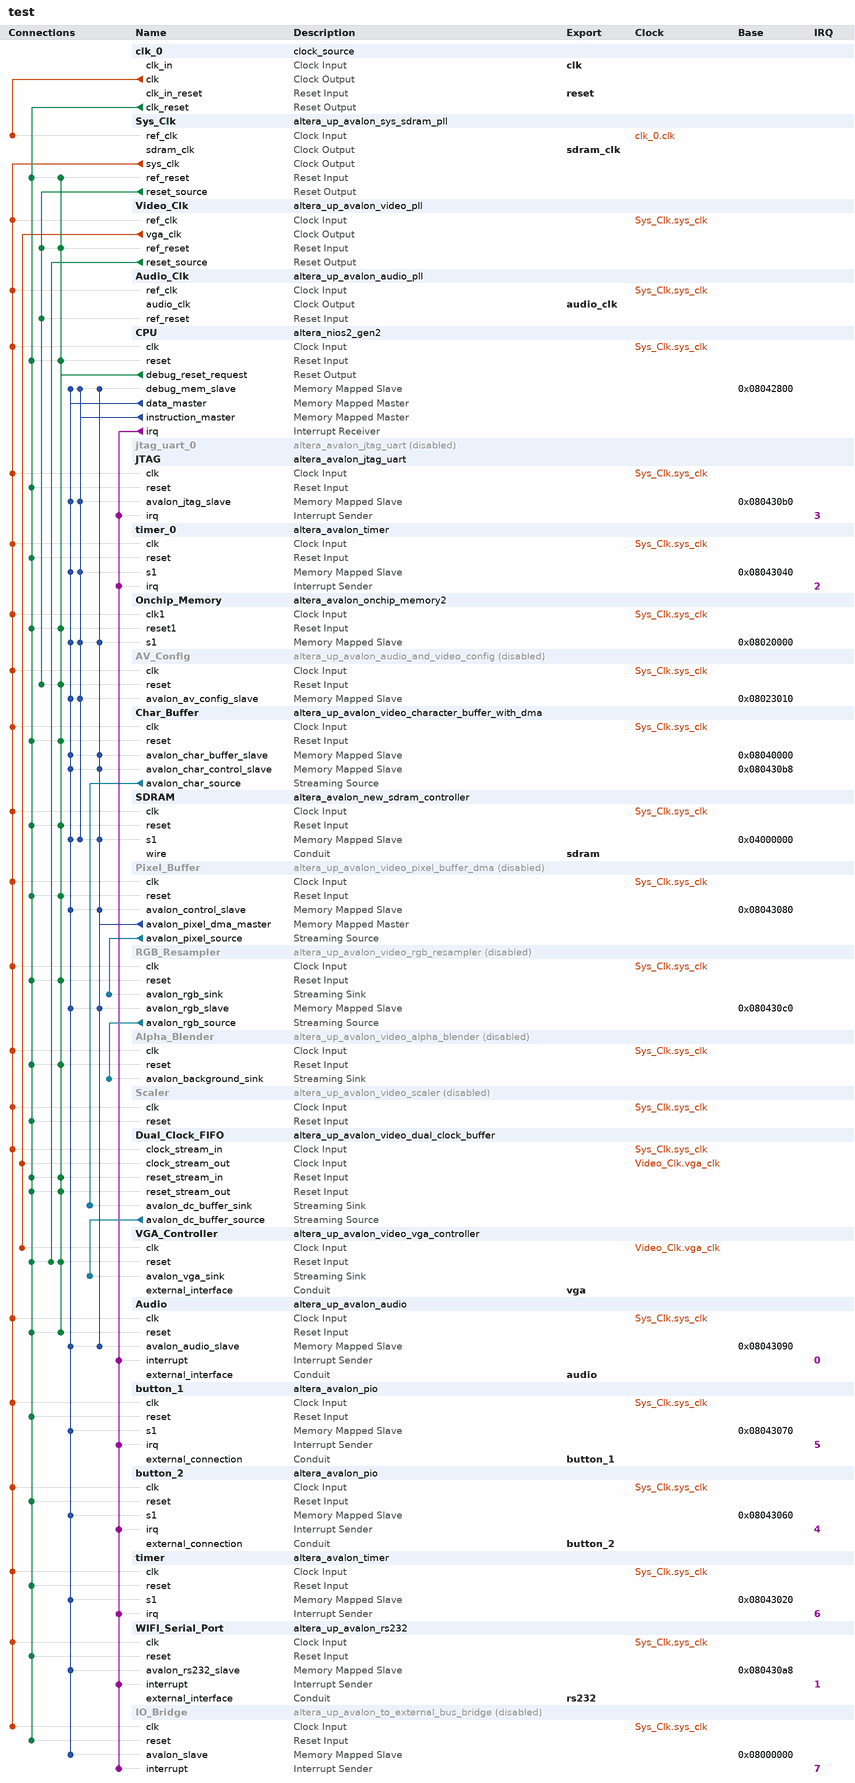
[diagram p0: system contents]
# Platform Designer (Qsys) system test, Cyclone V 5CSEMA5F31C6
# Parameters at their usual value, and those the tool derives, are not listed.
package require -exact qsys 18.0
create_system test
set_project_property DEVICE_FAMILY {Cyclone V}
set_project_property DEVICE 5CSEMA5F31C6

add_instance clk_0 clock_source 18.1
set_instance_parameter_value clk_0 clockFrequency 50000000

add_instance Sys_Clk altera_up_avalon_sys_sdram_pll 18.0
set_instance_parameter_value Sys_Clk CV_boards DE1-SoC
set_instance_parameter_value Sys_Clk gui_outclk 50.0
set_instance_parameter_value Sys_Clk gui_refclk 50.0

add_instance Video_Clk altera_up_avalon_video_pll 18.0
set_instance_parameter_value Video_Clk camera {5MP Digital Camera (THDB_D5M)}
set_instance_parameter_value Video_Clk gui_refclk 50.0
set_instance_parameter_value Video_Clk lcd {7" LCD on VEEK-MT and MTL/MTL2 Modules}

add_instance Audio_Clk altera_up_avalon_audio_pll 18.0
set_instance_parameter_value Audio_Clk gui_refclk 50.0

add_instance CPU altera_nios2_gen2 18.1
set_instance_parameter_value CPU dcache_size 2048
set_instance_parameter_value CPU exceptionSlave Onchip_Memory.s1
set_instance_parameter_value CPU icache_size 4096
set_instance_parameter_value CPU impl Fast
set_instance_parameter_value CPU resetSlave Onchip_Memory.s1

add_instance jtag_uart_0 altera_avalon_jtag_uart 18.1
set_instance_property jtag_uart_0 ENABLED false
set_instance_parameter_value jtag_uart_0 simInteractiveOptions NO_INTERACTIVE_WINDOWS

add_instance JTAG altera_avalon_jtag_uart 18.1
set_instance_parameter_value JTAG simInteractiveOptions NO_INTERACTIVE_WINDOWS

add_instance timer_0 altera_avalon_timer 18.1
set_instance_parameter_value timer_0 period 1
set_instance_parameter_value timer_0 periodUnits MSEC

add_instance Onchip_Memory altera_avalon_onchip_memory2 18.1
set_instance_parameter_value Onchip_Memory dataWidth 32
set_instance_parameter_value Onchip_Memory dualPort false
set_instance_parameter_value Onchip_Memory initMemContent true
set_instance_parameter_value Onchip_Memory initializationFileName onchip_mem.hex
set_instance_parameter_value Onchip_Memory memorySize 100000

add_instance AV_Config altera_up_avalon_audio_and_video_config 18.0
set_instance_property AV_Config ENABLED false
set_instance_parameter_value AV_Config audio_in {Microphone to ADC}
set_instance_parameter_value AV_Config bit_length 24
set_instance_parameter_value AV_Config board DE1-SoC
set_instance_parameter_value AV_Config eai false
set_instance_parameter_value AV_Config line_in_bypass false
set_instance_parameter_value AV_Config sampling_rate {48 kHz}

add_instance Char_Buffer altera_up_avalon_video_character_buffer_with_dma 18.0
set_instance_parameter_value Char_Buffer enable_transparency false

add_instance SDRAM altera_avalon_new_sdram_controller 18.1
set_instance_parameter_value SDRAM TAC 5.5
set_instance_parameter_value SDRAM TRCD 20.0
set_instance_parameter_value SDRAM TRP 20.0
set_instance_parameter_value SDRAM casLatency 3
set_instance_parameter_value SDRAM columnWidth 10
set_instance_parameter_value SDRAM dataWidth 16
set_instance_parameter_value SDRAM generateSimulationModel false
set_instance_parameter_value SDRAM model single_Micron_MT48LC4M32B2_7_chip
set_instance_parameter_value SDRAM numberOfBanks 4
set_instance_parameter_value SDRAM numberOfChipSelects 1
set_instance_parameter_value SDRAM powerUpDelay 100.0
set_instance_parameter_value SDRAM refreshPeriod 15.625
set_instance_parameter_value SDRAM rowWidth 13

add_instance Pixel_Buffer altera_up_avalon_video_pixel_buffer_dma 18.0
set_instance_property Pixel_Buffer ENABLED false
set_instance_parameter_value Pixel_Buffer addr_mode X-Y
set_instance_parameter_value Pixel_Buffer back_start_address 0
set_instance_parameter_value Pixel_Buffer color_space {8-bit RGB}
set_instance_parameter_value Pixel_Buffer image_height 480
set_instance_parameter_value Pixel_Buffer image_width 640
set_instance_parameter_value Pixel_Buffer start_address 0

add_instance RGB_Resampler altera_up_avalon_video_rgb_resampler 18.0
set_instance_property RGB_Resampler ENABLED false
set_instance_parameter_value RGB_Resampler alpha 1023
set_instance_parameter_value RGB_Resampler input_type {8-bit RGB}
set_instance_parameter_value RGB_Resampler output_type {30-bit RGB}

add_instance Alpha_Blender altera_up_avalon_video_alpha_blender 18.0
set_instance_property Alpha_Blender ENABLED false

add_instance Scaler altera_up_avalon_video_scaler 18.0
set_instance_property Scaler ENABLED false
set_instance_parameter_value Scaler color_bits 10
set_instance_parameter_value Scaler color_planes 3
set_instance_parameter_value Scaler height_scaling 2
set_instance_parameter_value Scaler width_in 320
set_instance_parameter_value Scaler width_scaling 2

add_instance Dual_Clock_FIFO altera_up_avalon_video_dual_clock_buffer 18.0
set_instance_parameter_value Dual_Clock_FIFO color_bits 10

add_instance VGA_Controller altera_up_avalon_video_vga_controller 18.0
set_instance_parameter_value VGA_Controller board DE1-SoC
set_instance_parameter_value VGA_Controller resolution {VGA 640x480}

add_instance Audio altera_up_avalon_audio 18.0
set_instance_parameter_value Audio audio_in true
set_instance_parameter_value Audio avalon_bus_type {Memory Mapped}
set_instance_parameter_value Audio dw 32

add_instance button_1 altera_avalon_pio 18.1
set_instance_parameter_value button_1 captureEdge true
set_instance_parameter_value button_1 direction Input
set_instance_parameter_value button_1 edgeType FALLING
set_instance_parameter_value button_1 generateIRQ true
set_instance_parameter_value button_1 width 1

add_instance button_2 altera_avalon_pio 18.1
set_instance_parameter_value button_2 captureEdge true
set_instance_parameter_value button_2 direction Input
set_instance_parameter_value button_2 edgeType FALLING
set_instance_parameter_value button_2 generateIRQ true
set_instance_parameter_value button_2 width 1

add_instance timer altera_avalon_timer 18.1
set_instance_parameter_value timer period 1
set_instance_parameter_value timer periodUnits MSEC

add_instance WIFI_Serial_Port altera_up_avalon_rs232 17.1
set_instance_parameter_value WIFI_Serial_Port baud 115200
set_instance_parameter_value WIFI_Serial_Port parity None

add_instance IO_Bridge altera_up_avalon_to_external_bus_bridge 18.0
set_instance_property IO_Bridge ENABLED false
set_instance_parameter_value IO_Bridge addr_size 64
set_instance_parameter_value IO_Bridge addr_size_multiplier Kbytes
set_instance_parameter_value IO_Bridge data_size 16

# connections
add_connection clk_0.clk Sys_Clk.ref_clk clock
add_connection Sys_Clk.sys_clk Alpha_Blender.clk clock
add_connection Sys_Clk.sys_clk Audio.clk clock
add_connection Sys_Clk.sys_clk Audio_Clk.ref_clk clock
add_connection Sys_Clk.sys_clk AV_Config.clk clock
add_connection Sys_Clk.sys_clk button_1.clk clock
add_connection Sys_Clk.sys_clk button_2.clk clock
add_connection Sys_Clk.sys_clk Char_Buffer.clk clock
add_connection Sys_Clk.sys_clk CPU.clk clock
add_connection Sys_Clk.sys_clk Dual_Clock_FIFO.clock_stream_in clock
add_connection Sys_Clk.sys_clk IO_Bridge.clk clock
add_connection Sys_Clk.sys_clk JTAG.clk clock
add_connection Sys_Clk.sys_clk Onchip_Memory.clk1 clock
add_connection Sys_Clk.sys_clk Pixel_Buffer.clk clock
add_connection Sys_Clk.sys_clk RGB_Resampler.clk clock
add_connection Sys_Clk.sys_clk Scaler.clk clock
add_connection Sys_Clk.sys_clk SDRAM.clk clock
add_connection Sys_Clk.sys_clk timer.clk clock
add_connection Sys_Clk.sys_clk timer_0.clk clock
add_connection Sys_Clk.sys_clk Video_Clk.ref_clk clock
add_connection Sys_Clk.sys_clk WIFI_Serial_Port.clk clock
add_connection Video_Clk.vga_clk Dual_Clock_FIFO.clock_stream_out clock
add_connection Video_Clk.vga_clk VGA_Controller.clk clock
add_connection clk_0.clk_reset Alpha_Blender.reset reset
add_connection clk_0.clk_reset Audio.reset reset
add_connection clk_0.clk_reset button_1.reset reset
add_connection clk_0.clk_reset button_2.reset reset
add_connection clk_0.clk_reset Char_Buffer.reset reset
add_connection clk_0.clk_reset CPU.reset reset
add_connection clk_0.clk_reset Dual_Clock_FIFO.reset_stream_in reset
add_connection clk_0.clk_reset Dual_Clock_FIFO.reset_stream_out reset
add_connection clk_0.clk_reset IO_Bridge.reset reset
add_connection clk_0.clk_reset JTAG.reset reset
add_connection clk_0.clk_reset Onchip_Memory.reset1 reset
add_connection clk_0.clk_reset Pixel_Buffer.reset reset
add_connection clk_0.clk_reset RGB_Resampler.reset reset
add_connection clk_0.clk_reset Scaler.reset reset
add_connection clk_0.clk_reset SDRAM.reset reset
add_connection clk_0.clk_reset Sys_Clk.ref_reset reset
add_connection clk_0.clk_reset timer.reset reset
add_connection clk_0.clk_reset timer_0.reset reset
add_connection clk_0.clk_reset VGA_Controller.reset reset
add_connection clk_0.clk_reset WIFI_Serial_Port.reset reset
add_connection CPU.debug_reset_request Alpha_Blender.reset reset
add_connection CPU.debug_reset_request Audio.reset reset
add_connection CPU.debug_reset_request AV_Config.reset reset
add_connection CPU.debug_reset_request Char_Buffer.reset reset
add_connection CPU.debug_reset_request CPU.reset reset
add_connection CPU.debug_reset_request Dual_Clock_FIFO.reset_stream_in reset
add_connection CPU.debug_reset_request Dual_Clock_FIFO.reset_stream_out reset
add_connection CPU.debug_reset_request Onchip_Memory.reset1 reset
add_connection CPU.debug_reset_request Pixel_Buffer.reset reset
add_connection CPU.debug_reset_request RGB_Resampler.reset reset
add_connection CPU.debug_reset_request SDRAM.reset reset
add_connection CPU.debug_reset_request Sys_Clk.ref_reset reset
add_connection CPU.debug_reset_request VGA_Controller.reset reset
add_connection CPU.debug_reset_request Video_Clk.ref_reset reset
add_connection Sys_Clk.reset_source Audio_Clk.ref_reset reset
add_connection Sys_Clk.reset_source AV_Config.reset reset
add_connection Sys_Clk.reset_source Video_Clk.ref_reset reset
add_connection Video_Clk.reset_source VGA_Controller.reset reset
add_connection CPU.data_master Audio.avalon_audio_slave avalon
set_connection_parameter_value CPU.data_master/Audio.avalon_audio_slave baseAddress 0x08043090
add_connection CPU.data_master AV_Config.avalon_av_config_slave avalon
set_connection_parameter_value CPU.data_master/AV_Config.avalon_av_config_slave baseAddress 0x08023010
add_connection CPU.data_master button_1.s1 avalon
set_connection_parameter_value CPU.data_master/button_1.s1 baseAddress 0x08043070
add_connection CPU.data_master button_2.s1 avalon
set_connection_parameter_value CPU.data_master/button_2.s1 baseAddress 0x08043060
add_connection CPU.data_master Char_Buffer.avalon_char_buffer_slave avalon
set_connection_parameter_value CPU.data_master/Char_Buffer.avalon_char_buffer_slave baseAddress 0x08040000
add_connection CPU.data_master Char_Buffer.avalon_char_control_slave avalon
set_connection_parameter_value CPU.data_master/Char_Buffer.avalon_char_control_slave baseAddress 0x080430b8
add_connection CPU.data_master CPU.debug_mem_slave avalon
set_connection_parameter_value CPU.data_master/CPU.debug_mem_slave baseAddress 0x08042800
add_connection CPU.data_master IO_Bridge.avalon_slave avalon
set_connection_parameter_value CPU.data_master/IO_Bridge.avalon_slave baseAddress 0x08000000
add_connection CPU.data_master JTAG.avalon_jtag_slave avalon
set_connection_parameter_value CPU.data_master/JTAG.avalon_jtag_slave baseAddress 0x080430b0
add_connection CPU.data_master Onchip_Memory.s1 avalon
set_connection_parameter_value CPU.data_master/Onchip_Memory.s1 baseAddress 0x08020000
add_connection CPU.data_master Pixel_Buffer.avalon_control_slave avalon
set_connection_parameter_value CPU.data_master/Pixel_Buffer.avalon_control_slave baseAddress 0x08043080
add_connection CPU.data_master RGB_Resampler.avalon_rgb_slave avalon
set_connection_parameter_value CPU.data_master/RGB_Resampler.avalon_rgb_slave baseAddress 0x080430c0
add_connection CPU.data_master SDRAM.s1 avalon
set_connection_parameter_value CPU.data_master/SDRAM.s1 baseAddress 0x04000000
add_connection CPU.data_master timer.s1 avalon
set_connection_parameter_value CPU.data_master/timer.s1 baseAddress 0x08043020
add_connection CPU.data_master timer_0.s1 avalon
set_connection_parameter_value CPU.data_master/timer_0.s1 baseAddress 0x08043040
add_connection CPU.data_master WIFI_Serial_Port.avalon_rs232_slave avalon
set_connection_parameter_value CPU.data_master/WIFI_Serial_Port.avalon_rs232_slave baseAddress 0x080430a8
add_connection CPU.instruction_master AV_Config.avalon_av_config_slave avalon
set_connection_parameter_value CPU.instruction_master/AV_Config.avalon_av_config_slave baseAddress 0x08023010
add_connection CPU.instruction_master CPU.debug_mem_slave avalon
set_connection_parameter_value CPU.instruction_master/CPU.debug_mem_slave baseAddress 0x08042800
add_connection CPU.instruction_master JTAG.avalon_jtag_slave avalon
set_connection_parameter_value CPU.instruction_master/JTAG.avalon_jtag_slave baseAddress 0x080430b0
add_connection CPU.instruction_master Onchip_Memory.s1 avalon
set_connection_parameter_value CPU.instruction_master/Onchip_Memory.s1 baseAddress 0x08020000
add_connection CPU.instruction_master SDRAM.s1 avalon
set_connection_parameter_value CPU.instruction_master/SDRAM.s1 baseAddress 0x04000000
add_connection CPU.instruction_master timer_0.s1 avalon
set_connection_parameter_value CPU.instruction_master/timer_0.s1 baseAddress 0x08043040
add_connection Pixel_Buffer.avalon_pixel_dma_master Audio.avalon_audio_slave avalon
set_connection_parameter_value Pixel_Buffer.avalon_pixel_dma_master/Audio.avalon_audio_slave baseAddress 0x08043090
add_connection Pixel_Buffer.avalon_pixel_dma_master Char_Buffer.avalon_char_buffer_slave avalon
set_connection_parameter_value Pixel_Buffer.avalon_pixel_dma_master/Char_Buffer.avalon_char_buffer_slave baseAddress 0x08040000
add_connection Pixel_Buffer.avalon_pixel_dma_master Char_Buffer.avalon_char_control_slave avalon
set_connection_parameter_value Pixel_Buffer.avalon_pixel_dma_master/Char_Buffer.avalon_char_control_slave baseAddress 0x080430b8
add_connection Pixel_Buffer.avalon_pixel_dma_master CPU.debug_mem_slave avalon
set_connection_parameter_value Pixel_Buffer.avalon_pixel_dma_master/CPU.debug_mem_slave baseAddress 0x08042800
add_connection Pixel_Buffer.avalon_pixel_dma_master Onchip_Memory.s1 avalon
set_connection_parameter_value Pixel_Buffer.avalon_pixel_dma_master/Onchip_Memory.s1 baseAddress 0x08020000
add_connection Pixel_Buffer.avalon_pixel_dma_master Pixel_Buffer.avalon_control_slave avalon
set_connection_parameter_value Pixel_Buffer.avalon_pixel_dma_master/Pixel_Buffer.avalon_control_slave baseAddress 0x08043080
add_connection Pixel_Buffer.avalon_pixel_dma_master RGB_Resampler.avalon_rgb_slave avalon
set_connection_parameter_value Pixel_Buffer.avalon_pixel_dma_master/RGB_Resampler.avalon_rgb_slave baseAddress 0x080430c0
add_connection Pixel_Buffer.avalon_pixel_dma_master SDRAM.s1 avalon
set_connection_parameter_value Pixel_Buffer.avalon_pixel_dma_master/SDRAM.s1 baseAddress 0x04000000
add_connection Char_Buffer.avalon_char_source Dual_Clock_FIFO.avalon_dc_buffer_sink avalon_streaming
add_connection Dual_Clock_FIFO.avalon_dc_buffer_source VGA_Controller.avalon_vga_sink avalon_streaming
add_connection Pixel_Buffer.avalon_pixel_source RGB_Resampler.avalon_rgb_sink avalon_streaming
add_connection RGB_Resampler.avalon_rgb_source Alpha_Blender.avalon_background_sink avalon_streaming
add_connection CPU.irq Audio.interrupt interrupt
set_connection_parameter_value CPU.irq/Audio.interrupt irqNumber 0
add_connection CPU.irq button_1.irq interrupt
set_connection_parameter_value CPU.irq/button_1.irq irqNumber 5
add_connection CPU.irq button_2.irq interrupt
set_connection_parameter_value CPU.irq/button_2.irq irqNumber 4
add_connection CPU.irq IO_Bridge.interrupt interrupt
set_connection_parameter_value CPU.irq/IO_Bridge.interrupt irqNumber 7
add_connection CPU.irq JTAG.irq interrupt
set_connection_parameter_value CPU.irq/JTAG.irq irqNumber 3
add_connection CPU.irq timer.irq interrupt
set_connection_parameter_value CPU.irq/timer.irq irqNumber 6
add_connection CPU.irq timer_0.irq interrupt
set_connection_parameter_value CPU.irq/timer_0.irq irqNumber 2
add_connection CPU.irq WIFI_Serial_Port.interrupt interrupt
set_connection_parameter_value CPU.irq/WIFI_Serial_Port.interrupt irqNumber 1

# exported interfaces
add_interface audio conduit end
set_interface_property audio EXPORT_OF Audio.external_interface
add_interface audio_clk clock source
set_interface_property audio_clk EXPORT_OF Audio_Clk.audio_clk
add_interface button_1 conduit end
set_interface_property button_1 EXPORT_OF button_1.external_connection
add_interface button_2 conduit end
set_interface_property button_2 EXPORT_OF button_2.external_connection
add_interface clk clock sink
set_interface_property clk EXPORT_OF clk_0.clk_in
add_interface reset reset sink
set_interface_property reset EXPORT_OF clk_0.clk_in_reset
add_interface rs232 conduit end
set_interface_property rs232 EXPORT_OF WIFI_Serial_Port.external_interface
add_interface sdram conduit end
set_interface_property sdram EXPORT_OF SDRAM.wire
add_interface sdram_clk clock source
set_interface_property sdram_clk EXPORT_OF Sys_Clk.sdram_clk
add_interface vga conduit end
set_interface_property vga EXPORT_OF VGA_Controller.external_interface

set_interconnect_requirement {$system} qsys_mm.clockCrossingAdapter HANDSHAKE
set_interconnect_requirement {$system} qsys_mm.enableEccProtection FALSE
set_interconnect_requirement {$system} qsys_mm.insertDefaultSlave FALSE
set_interconnect_requirement {$system} qsys_mm.maxAdditionalLatency 1

save_system test.qsys
